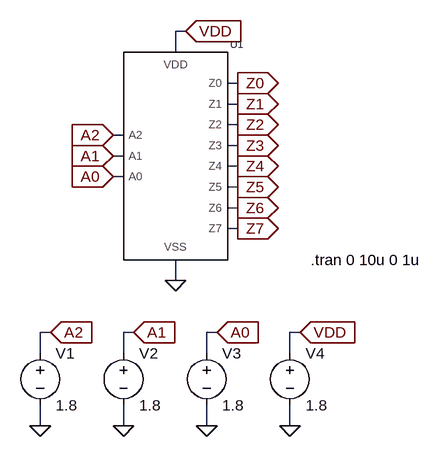
[diagram p0: schematic 3_to_8_Row_Decoder_Test.asc]
3_to_8_Row_Decoder_Test.asc, the LTspice schematic file:
Version 4.1
SHEET 1 880 680
WIRE 224 -16 208 -16
WIRE 208 16 208 -16
WIRE 304 64 288 64
WIRE 304 96 288 96
WIRE 304 128 288 128
WIRE 128 144 112 144
WIRE 304 160 288 160
WIRE 128 176 112 176
WIRE 304 192 288 192
WIRE 128 208 112 208
WIRE 304 224 288 224
WIRE 304 256 288 256
WIRE 304 288 288 288
WIRE 208 368 208 336
WIRE 16 448 0 448
WIRE 144 448 128 448
WIRE 272 448 256 448
WIRE 400 448 384 448
WIRE 0 480 0 448
WIRE 128 480 128 448
WIRE 256 480 256 448
WIRE 384 480 384 448
WIRE 0 592 0 560
WIRE 128 592 128 560
WIRE 256 592 256 560
WIRE 384 592 384 560
FLAG 224 -16 VDD
IOPIN 224 -16 In
FLAG 208 368 0
FLAG 112 144 A2
IOPIN 112 144 In
FLAG 112 176 A1
IOPIN 112 176 In
FLAG 112 208 A0
IOPIN 112 208 In
FLAG 304 64 Z0
IOPIN 304 64 Out
FLAG 304 96 Z1
IOPIN 304 96 Out
FLAG 304 128 Z2
IOPIN 304 128 Out
FLAG 304 160 Z3
IOPIN 304 160 Out
FLAG 304 192 Z4
IOPIN 304 192 Out
FLAG 304 224 Z5
IOPIN 304 224 Out
FLAG 304 256 Z6
IOPIN 304 256 Out
FLAG 304 288 Z7
IOPIN 304 288 Out
FLAG 0 592 0
FLAG 16 448 A2
IOPIN 16 448 In
FLAG 128 592 0
FLAG 144 448 A1
IOPIN 144 448 In
FLAG 256 592 0
FLAG 272 448 A0
IOPIN 272 448 In
FLAG 384 592 0
FLAG 400 448 VDD
IOPIN 400 448 In
SYMBOL 3_to_8_Row_Decoder_200207032_Nida_Mert\\3_to_8_Row_Decoder 208 176 R0
SYMATTR InstName U1
SYMBOL voltage 0 464 R0
WINDOW 123 0 0 Left 0
WINDOW 39 0 0 Left 0
SYMATTR InstName V1
SYMATTR Value 1.8
SYMBOL voltage 128 464 R0
WINDOW 123 0 0 Left 0
WINDOW 39 0 0 Left 0
SYMATTR InstName V2
SYMATTR Value 1.8
SYMBOL voltage 256 464 R0
WINDOW 123 0 0 Left 0
WINDOW 39 0 0 Left 0
SYMATTR InstName V3
SYMATTR Value 1.8
SYMBOL voltage 384 464 R0
WINDOW 123 0 0 Left 0
WINDOW 39 0 0 Left 0
SYMATTR InstName V4
SYMATTR Value 1.8
TEXT 416 336 Left 2 !.tran 0 10u 0 1u

The netlist it stands for:
* 3_to_8_Row_Decoder_Test.asc
X§U1 A2 A1 A0 Z0 Z1 Z2 Z3 Z4 Z5 Z6 Z7 VDD 0 3_to_8_Row_Decoder  ; pins A2 A1 A0 Z0 Z1 Z2 Z3 Z4 Z5 Z6 Z7 VDD VSS
V1 A2 0 1.8
V2 A1 0 1.8
V3 A0 0 1.8
V4 VDD 0 1.8
.tran 0 10u 0 1u
.lib 3_to_8_Row_Decoder.sub
.backanno
.end